# Altium project Sanseceller_PCB_v1.PrjPcb
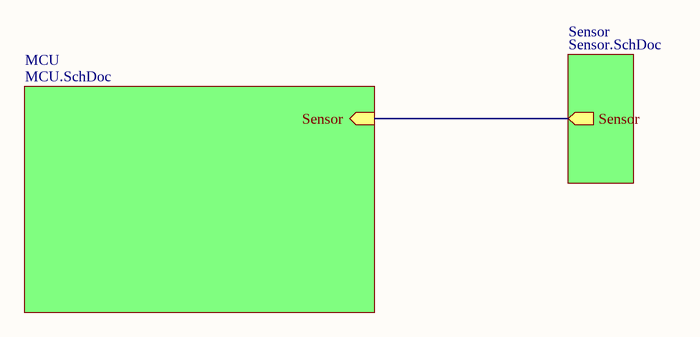
[diagram p0: Main.SchDoc]
3 sheets, 3 parts. Net scope: hierarchical (ports join the sheet entries above them; power ports are global).
Sheets:
  Main.SchDoc
    MCU = MCU.SchDoc
    Sensor = Sensor.SchDoc

## Sheet Main.SchDoc
size A4; SheetNumber: 1; SheetTotal: 3

### Sub-sheets
MCU = MCU.SchDoc: Sensor (in)
Sensor = Sensor.SchDoc: Sensor (out)

### Nets
Net*#2_2: sheet MCU/Sensor, sheet Sensor/Sensor

## Sheet MCU.SchDoc
size A4; SheetNumber: 2; SheetTotal: 3
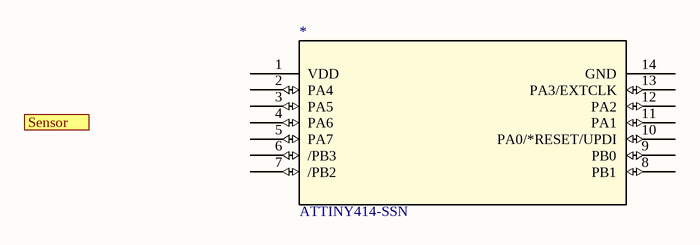
[diagram p1: MCU.SchDoc]

### Parts
(Parts that share a designator on the sheet are numbered #1, #2 ... from top to bottom, then left to right.)
*#1  ATTINY414-SSN

### Ports
Sensor

### Nets

Not connected (* = marked no-connect by the designer): *#1 1(VDD) 2(PA4) 3(PA5) 4(PA6) 5(PA7) 6(/PB3) 7(/PB2) 8(PB1) 9(PB0) 10(PA0/*RESET/UPDI) 11(PA1) 12(PA2) 13(PA3/EXTCLK) 14(GND)

## Sheet Sensor.SchDoc
size A4; SheetNumber: 3; SheetTotal: 3
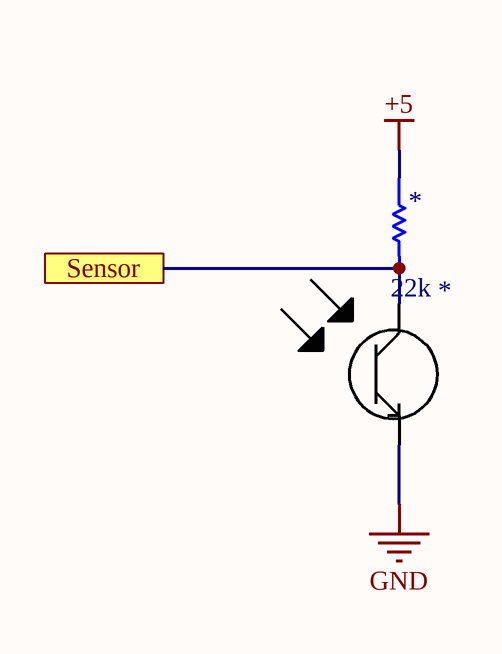
[diagram p2: Sensor.SchDoc]

### Parts
(Parts that share a designator on the sheet are numbered #1, #2 ... from top to bottom, then left to right.)
*#2  value 22k  [0402 Res]  (hidden comment: Resistor 0402 template)
*#3  APS3227SP1C-P22  [APS3227SP1C-P22]  (value not drawn)

### Ports
Sensor

### Nets
+5: *#2.1
GND: *#3.2(E)
Net*#2_2: *#2.2 *#3.1(C) ; port Sensor

### Library data of the parts
*#3 = APS3227SP1C-P22: Phototransistor